# EAGLE design material-sorter (EAGLE 8.5.0)
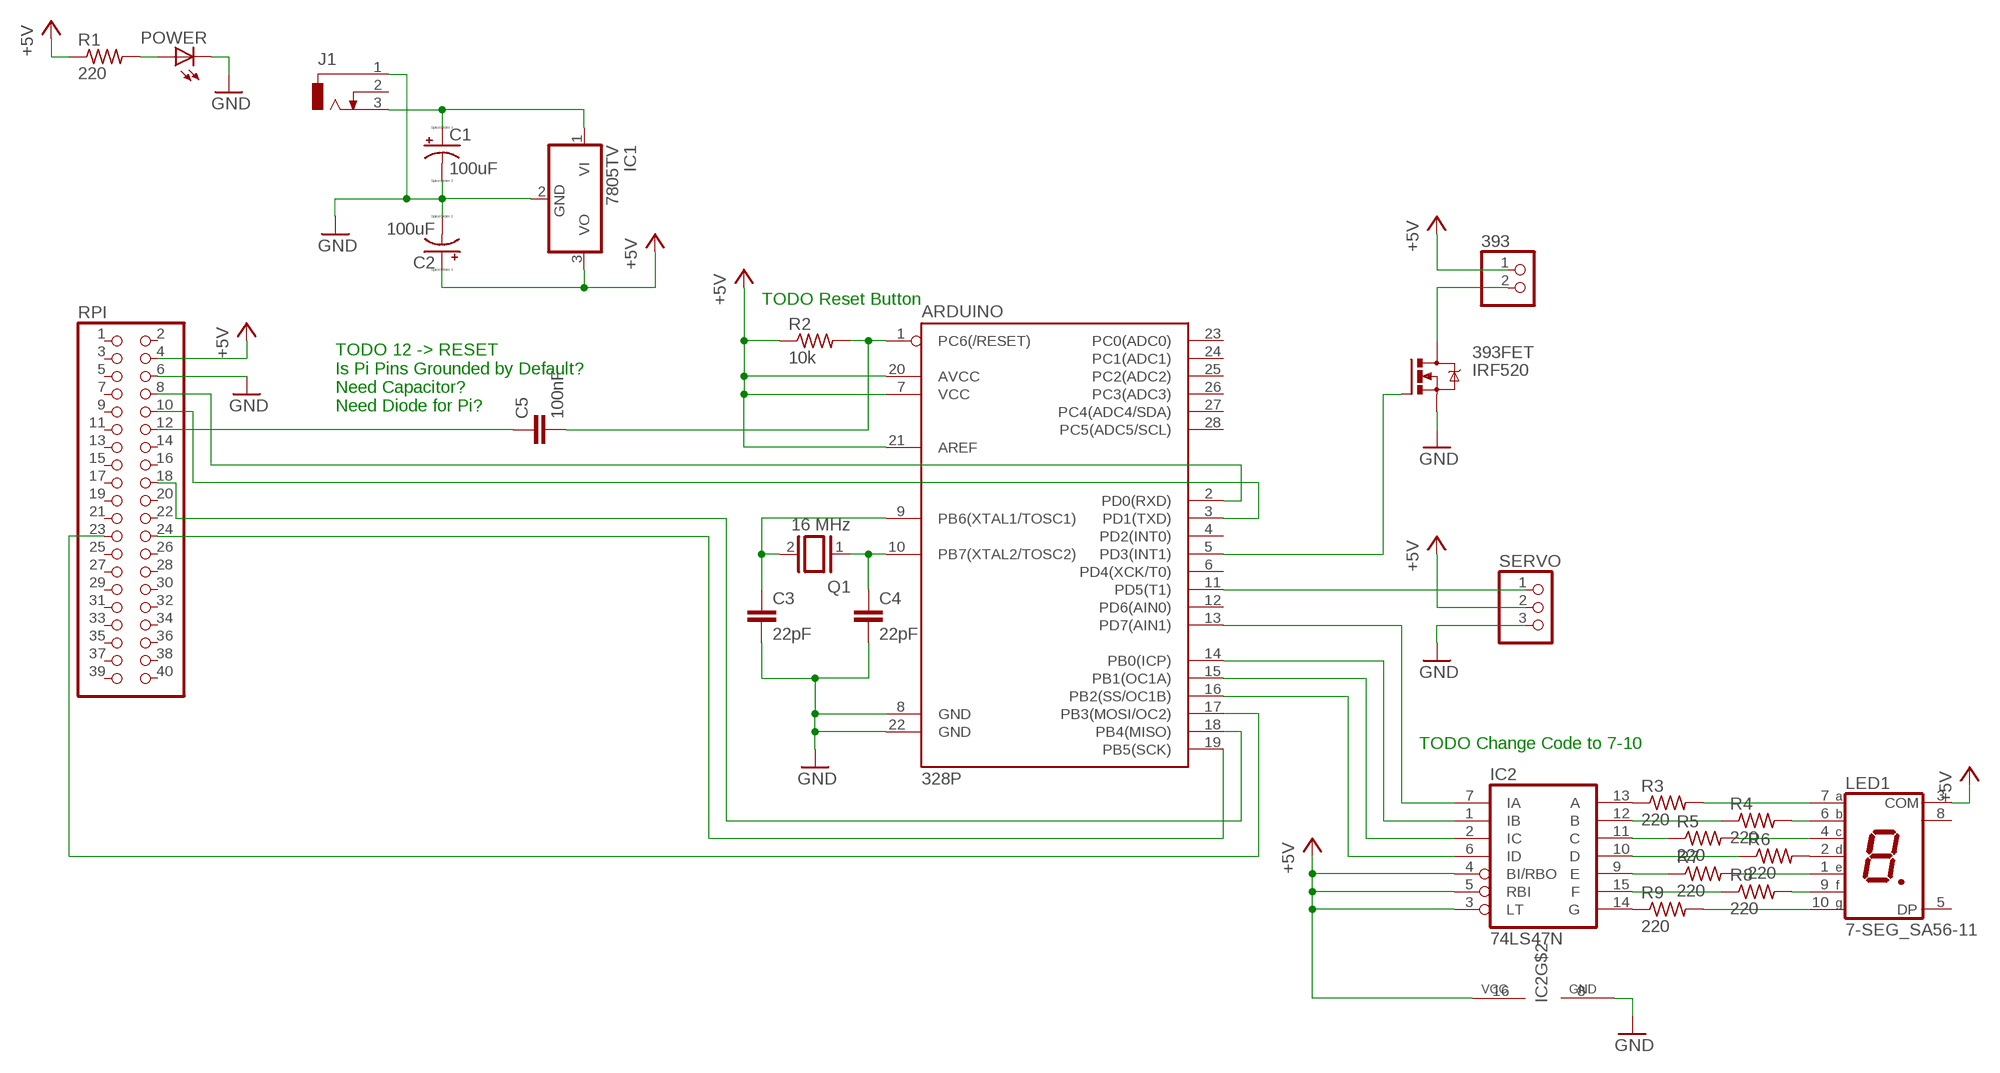
[diagram p0: schematic, sheet 1]

## Parts
393  PINHD-1X2  [1X02]
393FET  IRF520  [TO220BV]
ARDUINO  328P  ATMEGA328P_PDIP  [DIP28]
C1  100uF  CPOL-USE2.5-5  [E2,5-5]
C2  100uF  CPOL-USE2.5-5  [E2,5-5]
C3  22pF  C2.5/5  [C2.5-5]
C4  22pF  C2.5/5  [C2.5-5]
C5  100nF  C2.5/5  [C2.5-5]
IC1  7805TV  [TO220V]
IC2  74LS47N  [DIL16]
J1  DCJ0303  [DCJ0303]
LED1  7-SEG_SA56-11  [SA56-11]
POWER  LED5MM  [LED5MM]
Q1  16 MHz  XTAL/S  [QS]
R1  220  R-US_0207/2V  [0207/2V]
R2  10k  R-US_0207/2V  [0207/2V]
R3  220  R-US_0207/2V  [0207/2V]
R4  220  R-US_0207/2V  [0207/2V]
R5  220  R-US_0207/2V  [0207/2V]
R6  220  R-US_0207/2V  [0207/2V]
R7  220  R-US_0207/2V  [0207/2V]
R8  220  R-US_0207/2V  [0207/2V]
R9  220  R-US_0207/2V  [0207/2V]
RPI  PINHD-2X20  [2X20]
SERVO  PINHD-1X3  [1X03]

## Nets
+5V: 393.1 ARDUINO.7(VCC) ARDUINO.20(AVCC) ARDUINO.21(AREF) C2.+ IC1.3(VO) IC2.3(LT) IC2.4(BI/RBO) IC2.5(RBI) IC2.16(VCC) LED1.3(COM) R1.1 R2.1 RPI.4 SERVO.2
GND: 393FET.S ARDUINO.8(GND) ARDUINO.22(GND) C1.- C2.- C3.2 C4.2 IC1.2(GND) IC2.8(GND) J1.1 POWER.K(C) RPI.6 SERVO.3
N$1: ARDUINO.2(PD0(RXD)) RPI.8
N$2: ARDUINO.3(PD1(TXD)) RPI.10
N$3: ARDUINO.1(PC6(/RESET)) C5.2 R2.2
N$4: C1.+ IC1.1(VI) J1.3
N$5: ARDUINO.19(PB5(SCK)) RPI.24
N$6: POWER.A R1.2
N$7: ARDUINO.17(PB3(MOSI/OC2)) RPI.23
N$8: ARDUINO.18(PB4(MISO)) RPI.18
N$9: ARDUINO.10(PB7(XTAL2/TOSC2)) C4.1 Q1.1
N$10: ARDUINO.9(PB6(XTAL1/TOSC1)) C3.1 Q1.2
N$11: ARDUINO.11(PD5(T1)) SERVO.1
N$12: ARDUINO.13(PD7(AIN1)) IC2.7(IA)
N$13: 393FET.G ARDUINO.5(PD3(INT1))
N$14: 393.2 393FET.D
N$15: ARDUINO.14(PB0(ICP)) IC2.1(IB)
N$16: ARDUINO.15(PB1(OC1A)) IC2.2(IC)
N$17: ARDUINO.16(PB2(SS/OC1B)) IC2.6(ID)
N$18: C5.1 RPI.12
N$19: IC2.13(A) R3.1
N$20: LED1.2(D) R6.2
N$21: IC2.14(G) R9.1
N$22: LED1.7(A) R3.2
N$23: IC2.12(B) R4.1
N$24: LED1.6(B) R4.2
N$25: LED1.4(C) R5.2
N$26: LED1.1(E) R7.2
N$27: LED1.9(F) R8.2
N$28: LED1.10(G) R9.2
N$29: IC2.11(C) R5.1
N$30: IC2.10(D) R6.1
N$31: IC2.9(E) R7.1
N$32: IC2.15(F) R8.1
Unconnected: ARDUINO.4(PD2(INT0)) ARDUINO.6(PD4(XCK/T0)) ARDUINO.12(PD6(AIN0)) ARDUINO.23(PC0(ADC0)) ARDUINO.24(PC1(ADC1)) ARDUINO.25(PC2(ADC2)) ARDUINO.26(PC3(ADC3)) ARDUINO.27(PC4(ADC4/SDA)) ARDUINO.28(PC5(ADC5/SCL)) J1.2 LED1.5(DP) LED1.8(COM) RPI.1 RPI.2 RPI.3 RPI.5 RPI.7 RPI.9 RPI.11 RPI.13 RPI.14 RPI.15 RPI.16 RPI.17 RPI.19 RPI.20 RPI.21 RPI.22 RPI.25 RPI.26 RPI.27 RPI.28 RPI.29 RPI.30 RPI.31 RPI.32 RPI.33 RPI.34 RPI.35 RPI.36 RPI.37 RPI.38 RPI.39 RPI.40

## Notes on the sheet
- TODO Reset Button
- TODO 12 -> RESET
  Is Pi Pins Grounded by Default?
  Need Capacitor?
  Need Diode for Pi?
- TODO Change Code to 7-10

## Library data of the parts
393 = pinhead:PINHD-1X2: PIN HEADER
393FET = transistor-power:IRF520: HEXFET Power MOSFET
ARDUINO = SparkFun-IC-Microcontroller:ATMEGA328P_PDIP: Atmel 328P Through hole ATMEGA328P uC used in the Arduino 32kb flash, 1k EEPROM, 2k SRAM Datasheet <http://www.sparkfun.com/datasheets/Components/SMD/ATMega328.pdf> SparkFun Products Storefront component: AVR 28 Pin 20MHz 32K 6A/D - ATMega328P <https://www.sparkfun.com/products/9061> (COM-09061) SparkFun Simon Says - Through-Hole Soldering Kit <https://www.sparkfun.com/products/10547> (KIT-10547) SparkFun Learn to Solder - Simon Says <https://www.sparkfun.com/products/13708> (KIT-13708) SparkFun BigTime Watch Kit <https://www.sparkfun.com/products/11734> (KIT-11734) SparkFun ClockIt <https://www.sparkfun.com/products/10930> (KIT-10930) SparkFun Serial Enabled LCD Kit <https://www.sparkfun.com/products/10097> (LCD-10097) SparkFun Simon Tilts - Through Hole Soldering Kit <https://www.sparkfun.com/products/12634> (KIT-12634) SparkFun Frequency Counter Kit <https://www.sparkfun.com/products/10140> (KIT-10140) FabFM Radio Kit <https://www.sparkfun.com/products/11043> (KIT-11043) SparkFun Binary Blaster Kit <https://www.sparkfun.com/products/12037> (KIT-12037) SparkFun Metro-Gnome <https://www.sparkfun.com/products/9236> (KIT-09236) ATmega328 with Arduino Optiboot (Uno) <https://www.sparkfun.com/products/10524> (DEV-10524); PROD_ID: IC-09136
C1 C2 = resistor:CPOL-US: POLARIZED CAPACITOR, American symbol
C3-C5 = capacitor-wima:C: CAPACITOR naming: grid - package width
IC1 = linear:78*: Positive VOLTAGE REGULATOR Source: http://cache.national.com/ds/LM/LM78L05.pdf http://www.fairchildsemi.com/ds/LM/LM7805.pdf
IC2 = 74xx-us:74*47: BCD to seven segment DECODER/DRIVER Source: http://www.ee.washington.edu/stores/DataSheets/74ls/74ls47.pdf
J1 = con-jack:DCJ0303: DC POWER JACK Source: DCJ0303.pdf; OC_FARNELL: unknown; OC_NEWARK: unknown
LED1 = display-kingbright:7-SEG_: Kingbright 14.2mm (0.56 INCH) SINGLE DIGIT NUMERIC DUISPLAY Source: SA56-11EWA(Ver1189471036.pdf; OC_FARNELL: unknown; OC_NEWARK: unknown
POWER = led:LED: LED OSRAM: - CHIPLED LG R971, LG N971, LY N971, LG Q971, LY Q971, LO R971, LY R971 LH N974, LH R974 LS Q976, LO Q976, LY Q976 LO Q996 - Hyper CHIPLED LW Q18S LB Q993, LB Q99A, LB R99A - SideLED LS A670, LO A670, LY A670, LG A670, LP A670 LB A673, LV A673, LT A673, LW A673 LH A674 LY A675 LS A676, LA A676, LO A676, LY A676, LW A676 LS A679, LY A679, LG A679 - Hyper Micro SIDELED® LS Y876, LA Y876, LO Y876, LY Y876 LT Y87S - SmartLED LW L88C, LW L88S LB L89C, LB L89S, LG L890 LS L89K, LO L89K, LY L89K LS L896, LA L896, LO L896, LY L896 - TOPLED LS T670, LO T670, LY T670, LG T670, LP T670 LSG T670, LSP T670, LSY T670, LOP T670, LYG T670 LG T671, LOG T671, LSG T671 LB T673, LV T673, LT T673, LW T673 LH T674 LS T676, LA T676, LO T676, LY T676, LB T676, LH T676, LSB T676, LW T676 LB T67C, LV T67C, LT T67C, LS T67K, LO T67K, LY T67K, LW E67C LS E67B, LA E67B, LO E67B, LY E67B, LB E67C, LV E67C, LT E67C LW T67C LS T679, LY T679, LG T679 LS T770, LO T770, LY T770, LG T770, LP T770 LB T773, LV T773, LT T773, LW T773 LH T774 LS E675, LA E675, LY E675, LS T675 LS T776, LA T776, LO T776, LY T776, LB T776 LHGB T686 LT T68C, LB T68C - Hyper Mini TOPLED® LB M676 - Mini TOPLED Santana® LG M470 LS M47K, LO M47K, LY M47K Source: http://www.osram.convergy.de LUXEON: - LUMILED® LXK2-PW12-R00, LXK2-PW12-S00, LXK2-PW14-U00, LXK2-PW14-V00 LXK2-PM12-R00, LXK2-PM12-S00, LXK2-PM14-U00 LXK2-PE12-Q00, LXK2-PE12-R00, LXK2-PE12-S00, LXK2-PE14-T00, LXK2-PE14-U00 LXK2-PB12-K00, LXK2-PB12-L00, LXK2-PB12-M00, LXK2-PB14-N00, LXK2-PB14-P00, LXK2-PB14-Q00 LXK2-PR12-L00, LXK2-PR12-M00, LXK2-PR14-Q00, LXK2-PR14-R00 LXK2-PD12-Q00, LXK2-PD12-R00, LXK2-PD12-S00 LXK2-PH12-R00, LXK2-PH12-S00 LXK2-PL12-P00, LXK2-PL12-Q00, LXK2-PL12-R00 Source: www.luxeon.com KINGBRIGHT: KA-3528ASYC Source: www.kingbright.com
Q1 = special:XTAL/S: CRYSTAL
R1-R9 = resistor:R-US_: RESISTOR, American symbol
RPI = pinhead:PINHD-2X20: PIN HEADER
SERVO = pinhead:PINHD-1X3: PIN HEADER

## Board
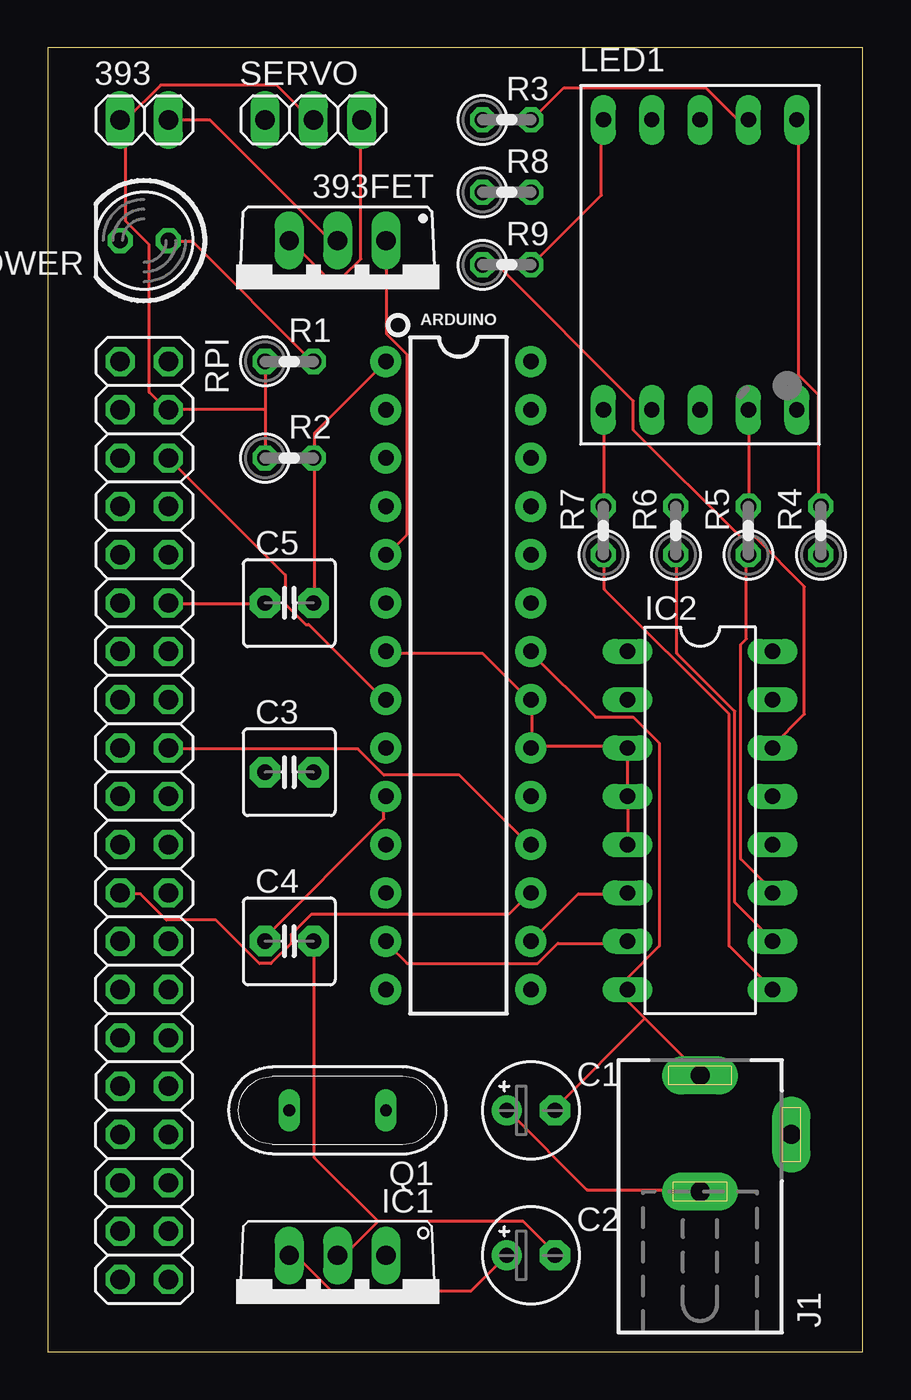
[diagram p1: board, top side]
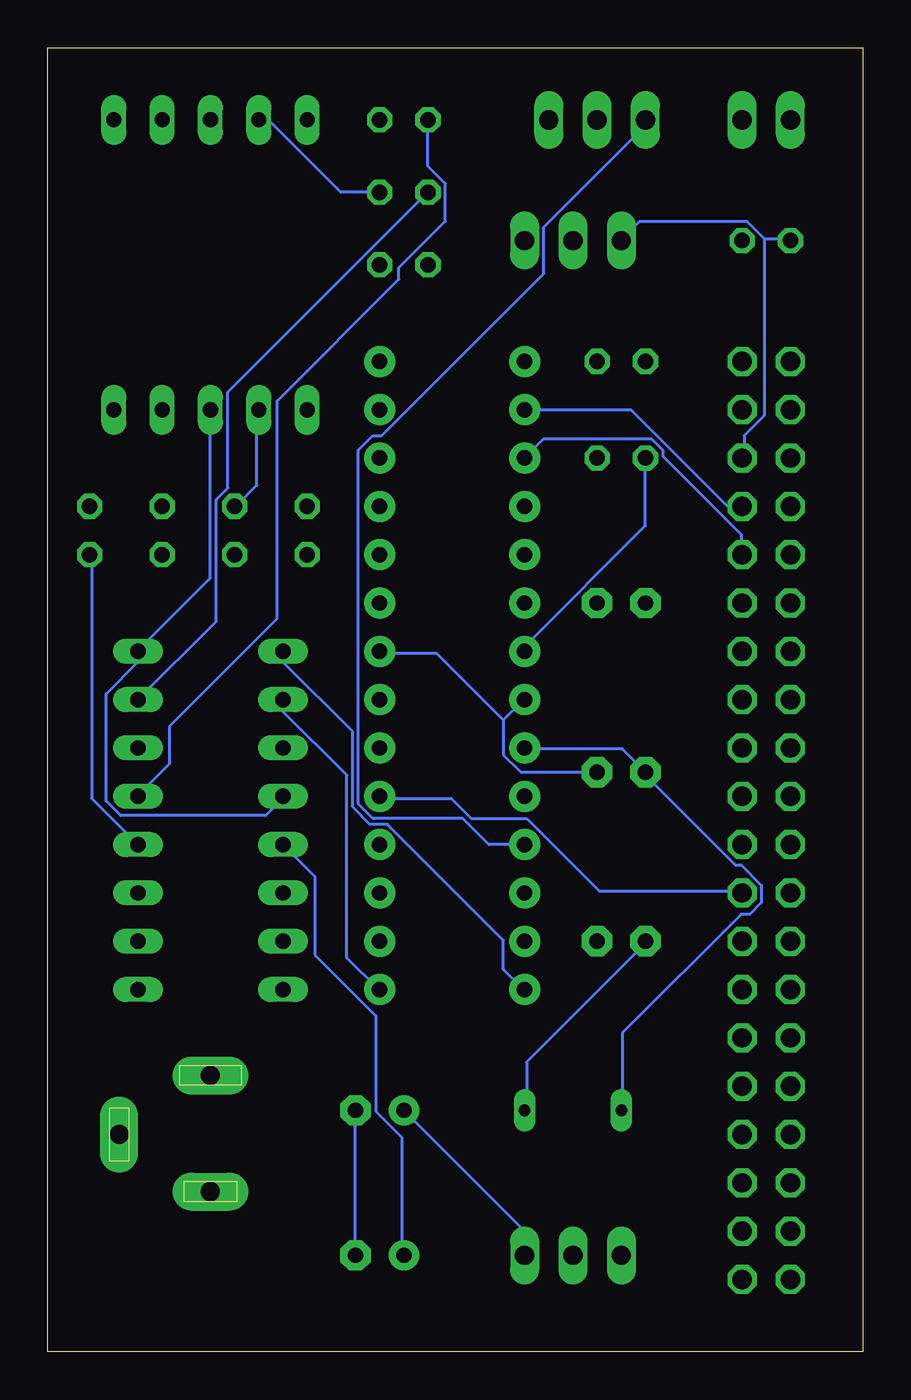
[diagram p2: board, bottom side, seen from below]

Size 42.85 x 68.57 mm. Coordinates in mm from the lower left corner, seen from the top.
Outline: 0,0 42.85,0 42.85,68.57 0,68.57 0,0
Copper layers (1*16): Top 0.035mm / dielectric 1.5mm / Bottom 0.035mm
Design rules "default": minimum track width 6mil, minimum drill 0.35mm, track to track 6mil, track to pad 6mil, pad to pad 6mil, via to via 6mil, smd to smd 6mil, copper to edge 40mil, drill to drill 6mil, minimum pad ring 10mil, minimum via ring 8mil, stop-mask expansion 4mil, vias tented up to drill 0mil, thermal gap 10mil

### Footprints (pad centres in the part's own frame; a part is rotated, then mirrored left to right if it is on the bottom)
1X02 = drill 1.016 long: 1 -1.27,0; 2 1.27,0
TO220BV = drill 1.016 long: D 0,-2.54; G -2.54,-2.54; S 2.54,-2.54
DIP28 = drill 0.813 pad 1.626: 1 -16.51,-3.81; 2 -13.97,-3.81; 3 -11.43,-3.81; 4 -8.89,-3.81; 5 -6.35,-3.81; 6 -3.81,-3.81; 7 -1.27,-3.81; 8 1.27,-3.81; 9 3.81,-3.81; 10 6.35,-3.81; 11 8.89,-3.81; 12 11.43,-3.81; 13 13.97,-3.81; 14 16.51,-3.81; 15 16.51,3.81; 16 13.97,3.81; 17 11.43,3.81; 18 8.89,3.81; 19 6.35,3.81; 20 3.81,3.81; 21 1.27,3.81; 22 -1.27,3.81; 23 -3.81,3.81; 24 -6.35,3.81; 25 -8.89,3.81; 26 -11.43,3.81; 27 -13.97,3.81; 28 -16.51,3.81
E2,5-5 = drill 0.813 pad 1.6: + -1.27,0 | drill 0.813 pad 1.6 octagon: - 1.27,0
C2.5-5 = drill 0.813 pad 1.6 octagon: 1 -1.27,0; 2 1.27,0
TO220V = drill 1.016 long: 1 -2.54,-2.54; 2 0,-2.54; 3 2.54,-2.54
DIL16 = drill 0.813 long: 1 -8.89,-3.81; 2 -6.35,-3.81; 3 -3.81,-3.81; 4 -1.27,-3.81; 5 1.27,-3.81; 6 3.81,-3.81; 7 6.35,-3.81; 8 8.89,-3.81; 9 8.89,3.81; 10 6.35,3.81; 11 3.81,3.81; 12 1.27,3.81; 13 -1.27,3.81; 14 -3.81,3.81; 15 -6.35,3.81; 16 -8.89,3.81
DCJ0303 = drill 1 pad 2 long: 1 0,3.1; 2 4.8,0; 3 0,-3
SA56-11 = drill 0.8 long: 1 -5.08,-7.62; 2 -2.54,-7.62; 3 0,-7.62; 4 2.54,-7.62; 5 5.08,-7.62; 6 5.08,7.62; 7 2.54,7.62; 8 0,7.62; 9 -2.54,7.62; 10 -5.08,7.62
LED5MM = drill 0.813 octagon: A -1.27,0; K 1.27,0
QS = drill 0.61 long: 1 -2.54,0; 2 2.54,0
0207/2V = drill 0.813 octagon: 1 -1.27,0; 2 1.27,0
2X20 = drill 1.016 octagon: 1 -24.13,-1.27; 2 -24.13,1.27; 3 -21.59,-1.27; 4 -21.59,1.27; 5 -19.05,-1.27; 6 -19.05,1.27; 7 -16.51,-1.27; 8 -16.51,1.27; 9 -13.97,-1.27; 10 -13.97,1.27; 11 -11.43,-1.27; 12 -11.43,1.27; 13 -8.89,-1.27; 14 -8.89,1.27; 15 -6.35,-1.27; 16 -6.35,1.27; 17 -3.81,-1.27; 18 -3.81,1.27; 19 -1.27,-1.27; 20 -1.27,1.27; 21 1.27,-1.27; 22 1.27,1.27; 23 3.81,-1.27; 24 3.81,1.27; 25 6.35,-1.27; 26 6.35,1.27; 27 8.89,-1.27; 28 8.89,1.27; 29 11.43,-1.27; 30 11.43,1.27; 31 13.97,-1.27; 32 13.97,1.27; 33 16.51,-1.27; 34 16.51,1.27; 35 19.05,-1.27; 36 19.05,1.27; 37 21.59,-1.27; 38 21.59,1.27; 39 24.13,-1.27; 40 24.13,1.27
1X03 = drill 1.016 long: 1 -2.54,0; 2 0,0; 3 2.54,0

### Placement (x,y rotation side)
393  5.08,64.77 0 top
393FET  15.24,55.88 180 top
ARDUINO  21.59,35.56 270 top
C1  25.4,12.7 0 top
C2  25.4,5.08 0 top
C3  12.7,30.48 0 top
C4  12.7,21.59 0 top
C5  12.7,39.37 0 top
IC1  15.24,2.54 180 top
IC2  34.29,27.94 270 top
J1  34.29,11.43 0 top
LED1  34.29,57.15 0 top
POWER  5.08,58.42 180 top
Q1  15.24,12.7 180 top
R1  12.7,52.07 0 top
R2  12.7,46.99 0 top
R3  24.13,64.77 0 top
R4  40.64,43.18 90 top
R5  36.83,43.18 90 top
R6  33.02,43.18 90 top
R7  29.21,43.18 90 top
R8  24.13,60.96 0 top
R9  24.13,57.15 0 top
RPI  5.08,27.94 270 top
SERVO  13.97,64.77 0 top

### Tracks (layer width: path | path; a pad name or v marks a point on that pad's centre or on a via)
+5V
  Top 0.152: C2.+ 22.25,3.2 14.94,3.2 13.11,5.03 12.8,5.03 IC1.3 | 4.12,64.77 5.94,66.6 12.04,66.6 13.87,64.77 SERVO.2 | R1.1 11.43,49.53 | 11.43,49.53 R2.1 | 11.43,49.53 RPI.4 6.25,49.53 5.33,50.44 5.33,58.22 4.12,59.44 4.12,64.77 | IC2.5 IC2.4 IC2.3 30.48,31.85 25.45,31.85 | ARDUINO.7 17.83,36.73 22.86,36.73 25.3,34.29 ARDUINO.21 25.45,34.29 25.45,31.85 | 25.45,31.85 ARDUINO.20 | 4.12,64.77 393.1
  Bottom 0.152: LED1.3 34.29,40.69 38.1,36.88 IC2.16 38.1,36.27 39.78,34.59 39.78,28.96 39.01,28.19 31.39,28.19 30.48,29.11 IC2.4 | R2.1 11.43,43.43 17.68,37.19 17.68,36.88 ARDUINO.7 | IC2.5 28.8,24.99 28.8,20.88 25.6,17.68 25.6,12.65 24.23,11.28 24.23,5.18 C2.+
GND
  Top 0.152: 31.39,17.53 34.29,14.63 J1.1 | 31.39,17.53 30.48,18.44 IC2.8 30.48,19.66 32.16,21.34 32.16,32 30.79,33.38 28.8,33.38 25.45,36.73 ARDUINO.22 | 31.39,17.53 26.67,12.8 C1.- | 17.37,6.86 15.7,5.18 15.24,5.18 IC1.2 | 17.37,6.86 24.99,6.86 26.67,5.18 C2.- | 17.37,6.86 14.02,10.21 14.02,21.49 C4.2 | SERVO.3 16.46,64.77 16.46,57.45 15.54,56.54 14.63,56.54 12.8,58.37 393FET.S | RPI.6 12.5,40.84 12.5,39.32 13.56,38.25 13.72,38.25 17.68,34.29 ARDUINO.8
  Bottom 0.152: C2.- C1.- | C3.2 17.98,30.48 18.9,31.39 18.9,33.22 | 18.9,33.22 17.83,34.29 ARDUINO.8 | 18.9,33.22 22.4,36.73 25.3,36.73 ARDUINO.22 | 5.18,58.52 3.81,58.52 POWER.K | 5.18,58.52 6.1,59.44 11.73,59.44 12.65,58.52 393FET.S | 5.18,58.52 5.18,49.23 6.25,48.16 6.25,47.09 RPI.6
N$1
  Bottom 0.152: ARDUINO.2 12.19,49.53 7.16,44.5 6.4,44.5 RPI.8
N$2
  Bottom 0.152: ARDUINO.3 16.76,48.01 11.12,48.01 10.52,47.4 10.52,47.09 6.4,42.98 6.4,41.91 RPI.10
N$3
  Top 0.152: ARDUINO.1 14.02,48.31 14.02,47.09 R2.2 14.02,46.94 14.02,39.47 C5.2
N$4
  Top 0.152: J1.3 34.29,8.53 28.35,8.53 24.23,12.65 C1.+
  Bottom 0.152: C1.+ 17.83,6.4 17.83,5.18 IC1.1
N$5
  Bottom 0.152: RPI.24 6.4,24.23 13.87,24.23 17.68,28.04 20.57,28.04 21.64,29.11 25.3,29.11 ARDUINO.19
N$6
  Top 0.152: POWER.A 6.4,58.37 7.62,58.37 13.87,52.12 R1.2
N$7
  Top 0.152: RPI.23 3.81,24.08 4.88,24.08 6.25,22.71 8.84,22.71 11.12,20.42 11.73,20.42 12.8,21.49 12.8,21.95 13.87,23.01 24.23,23.01 25.3,24.08 ARDUINO.17
N$8
  Top 0.152: RPI.18 6.4,31.7 16.31,31.7 17.68,30.33 21.64,30.33 25.3,26.67 ARDUINO.18
N$9
  Top 0.152: C4.1 11.43,21.79 17.68,28.04 17.68,29.11 ARDUINO.10
  Bottom 0.152: Q1.1 17.68,12.8 17.68,15.24 11.43,21.49 C4.1
N$10
  Bottom 0.152: Q1.2 12.65,12.8 12.65,16.76 6.4,23.01 5.94,23.01 5.33,23.62 5.33,24.54 6.4,25.6 6.71,25.6 11.43,30.33 C3.1 12.65,31.7 17.68,31.7 ARDUINO.9
N$11
  Bottom 0.152: SERVO.1 11.43,64.47 16.76,59.13 16.76,56.69 25.3,48.16 25.76,48.16 26.52,47.4 26.52,28.8 25.76,28.04 21.03,28.04 19.66,26.67 ARDUINO.11
N$12
  Top 0.152: IC2.7 30.48,21.49 26.82,21.49 25.76,20.42 18.9,20.42 17.83,21.49 ARDUINO.13
N$13
  Top 0.152: 393FET.G 17.83,58.37 17.83,53.49 18.9,52.43 18.9,42.98 17.83,41.91 ARDUINO.5
N$14
  Top 0.152: 393.2 8.53,64.77 14.78,58.52 15.24,58.52 393FET.D
N$15
  Bottom 0.152: IC2.1 30.48,36.27 26.82,32.61 26.82,28.65 25.91,27.74 24.99,27.74 18.9,21.64 18.9,20.12 17.83,19.05 ARDUINO.14
N$16
  Bottom 0.152: IC2.2 30.48,33.68 27.13,30.33 27.13,20.73 25.45,19.05 ARDUINO.15
N$17
  Top 0.152: ARDUINO.16 27.89,24.08 30.48,24.08 IC2.6
N$18
  Top 0.152: RPI.12 6.4,39.32 11.43,39.32 C5.1
N$19
  Bottom 0.152: R3.1 22.86,62.33 21.95,61.42 21.95,59.44 24.38,57 24.38,56.39 30.79,49.99 30.79,38.56 36.42,32.92 36.42,30.94 38.1,29.26 IC2.13
N$20
  Bottom 0.152: LED1.2 31.85,49.53 31.85,45.57 32.92,44.5 R6.2
N$21
  Top 0.152: R9.1 23.62,57.15 30.79,49.99 30.79,48.46 36.42,42.82 37.19,42.82 39.78,40.23 39.78,33.53 38.1,31.85 IC2.14
N$22
  Top 0.152: LED1.7 36.27,64.77 34.59,66.45 27.13,66.45 25.45,64.77 R3.2
N$23
  Bottom 0.152: IC2.12 40.54,29.11 40.54,41.91 R4.1
N$24
  Top 0.152: LED1.6 39.47,64.77 39.47,51.36 40.54,50.29 40.54,44.5 R4.2
N$25
  Top 0.152: LED1.4 36.88,49.53 36.88,44.5 R5.2
N$26
  Top 0.152: LED1.1 29.26,49.53 29.26,44.5 R7.2
N$27
  Bottom 0.152: LED1.9 31.24,64.77 27.43,60.96 R8.2
N$28
  Top 0.152: LED1.10 29.11,64.77 29.11,60.81 25.45,57.15 R9.2
N$29
  Top 0.152: R5.1 36.73,41.91 36.73,37.49 36.42,37.19 36.42,25.91 38.1,24.23 IC2.11
N$30
  Top 0.152: R6.1 33.07,41.91 33.07,36.73 36.12,33.68 36.12,23.62 38.1,21.64 IC2.10
N$31
  Top 0.152: IC2.9 35.81,21.34 35.81,33.53 29.26,40.08 29.26,41.91 R7.1
N$32
  Bottom 0.152: R8.1 33.38,50.44 33.38,45.41 33.98,44.81 33.98,38.41 IC2.15